# EAGLE design 1tm32 (EAGLE 9.6.2)
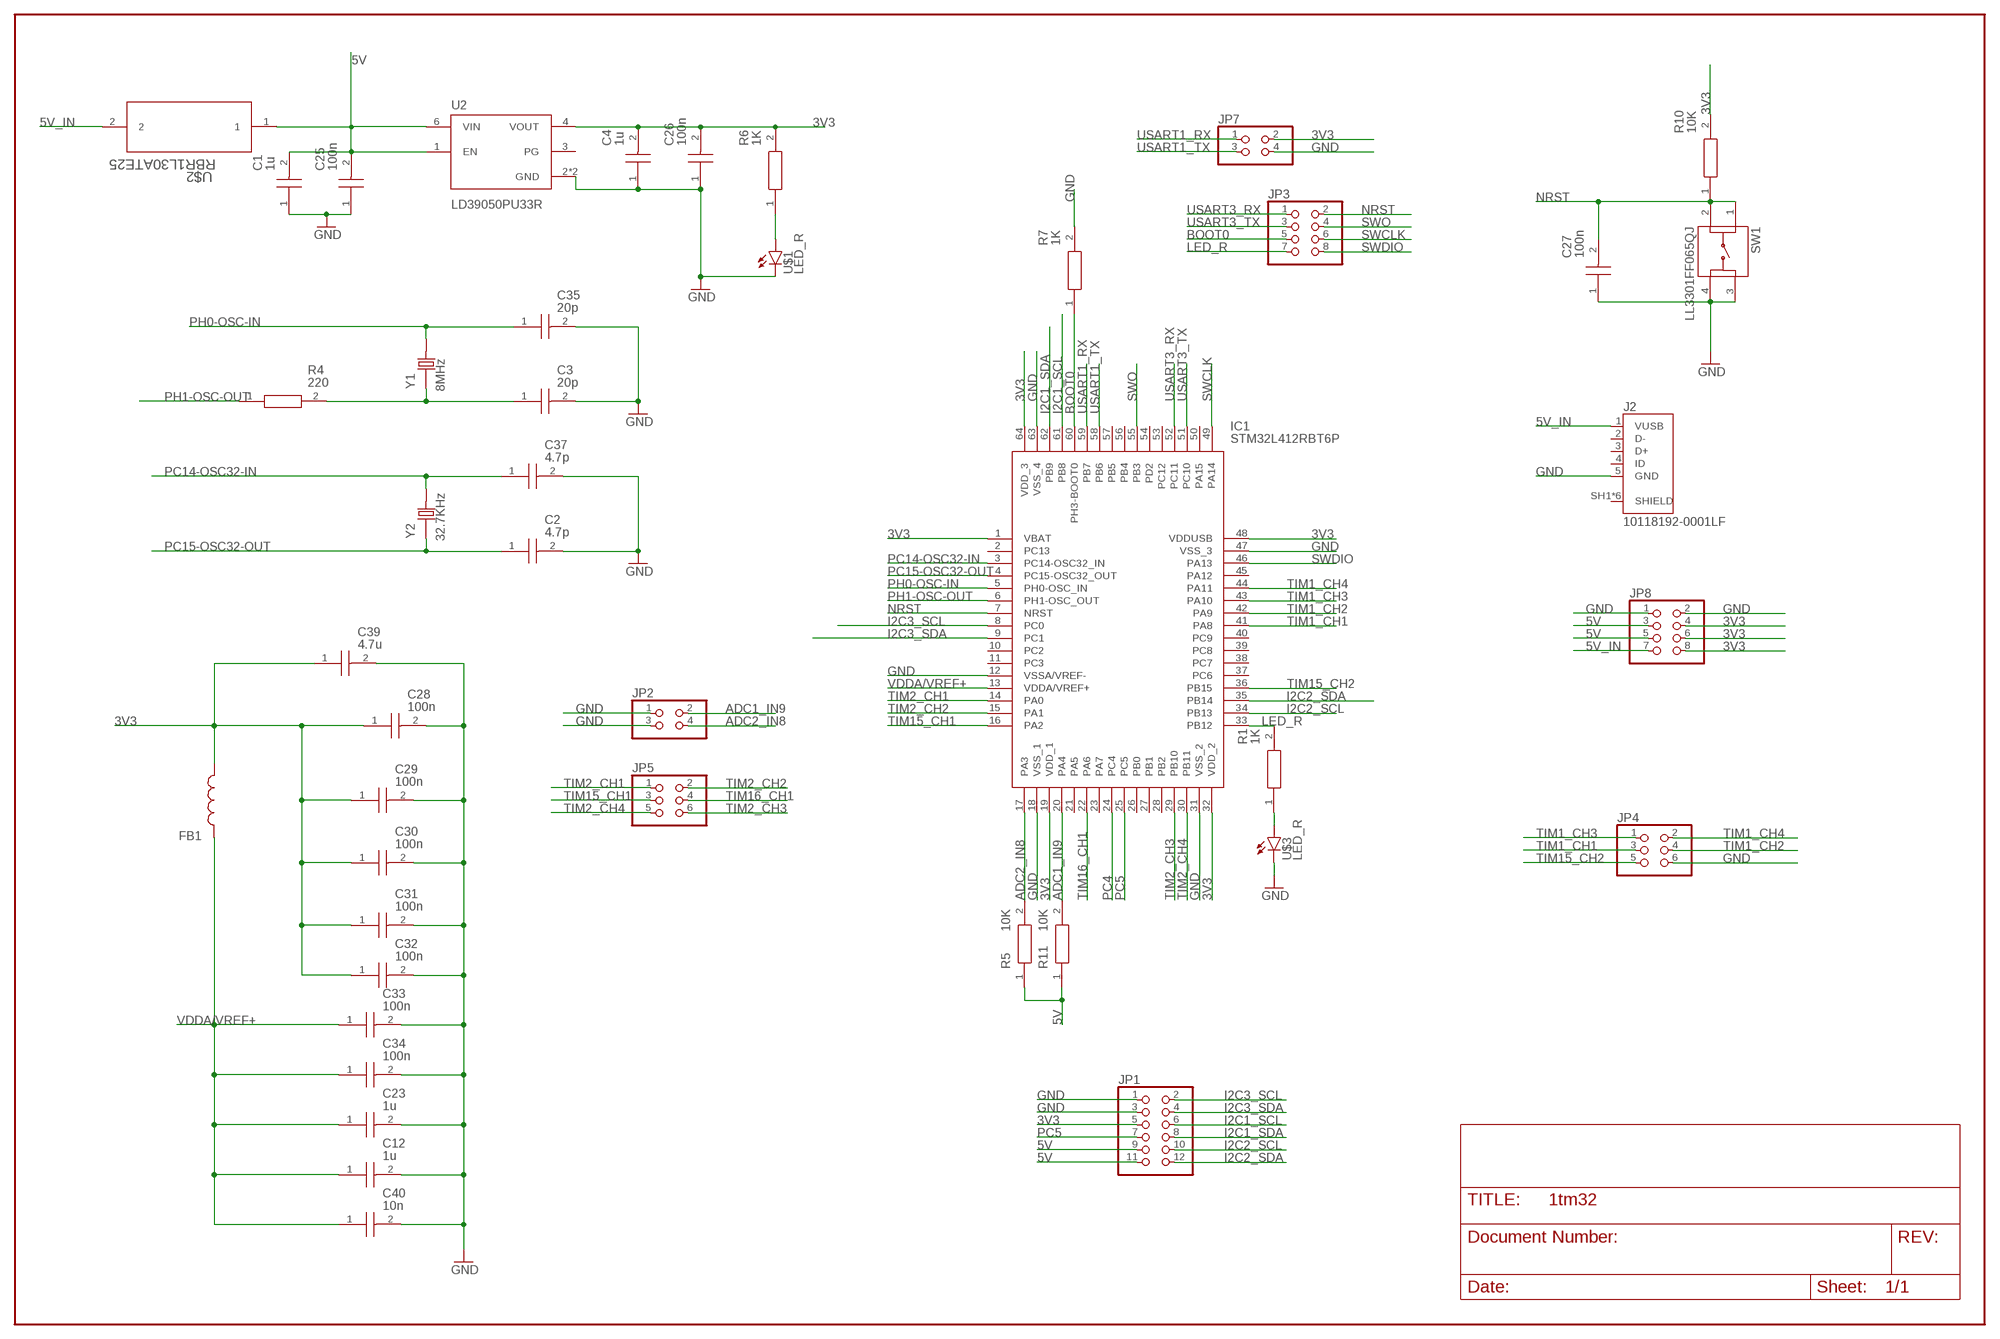
[diagram p0: schematic, sheet 1]

## Parts
C1  1u  GRM219R61H105KA73D  [CAPC2012X95N]
C2  4.7p  GQM2195C2E4R7BB12D  [CAPC2012X100N]
C3  20p  GQM2195G2H200GB12D  [CAPC2012X100N]
C4  1u  GRM219R61H105KA73D  [CAPC2012X95N]
C12  1u  GRM219R61H105KA73D  [CAPC2012X95N]
C23  1u  GRM219R61H105KA73D  [CAPC2012X95N]
C25  100n  GRT31C5C2A104JA12L  [CAPC3216X180N]
C26  100n  GRT31C5C2A104JA12L  [CAPC3216X180N]
C27  100n  GRT31C5C2A104JA12L  [CAPC3216X180N]
C28  100n  GRT31C5C2A104JA12L  [CAPC3216X180N]
C29  100n  GRT31C5C2A104JA12L  [CAPC3216X180N]
C30  100n  GRT31C5C2A104JA12L  [CAPC3216X180N]
C31  100n  GRT31C5C2A104JA12L  [CAPC3216X180N]
C32  100n  GRT31C5C2A104JA12L  [CAPC3216X180N]
C33  100n  GRT31C5C2A104JA12L  [CAPC3216X180N]
C34  100n  GRT31C5C2A104JA12L  [CAPC3216X180N]
C35  20p  GQM2195G2H200GB12D  [CAPC2012X100N]
C37  4.7p  GQM2195C2E4R7BB12D  [CAPC2012X100N]
C39  4.7u  GRT21BC71H475KE13L  [CAPC2012X145N]
C40  10n  GRM31CR73A103KW03L  [CAPC3216X180N]
FB1  BK1608HS601-T  [BEADC1608X95N]
IC1  STM32L412RBT6P  [QFP50P1200X1200X160-64N]
J2  10118192-0001LF  [AMPHENOL_10118192-0001LF]
JP1  PINHD-2X6  [2X06]
JP2  PINHD-2X2  [2X02]
JP3  PINHD-2X4  [2X04]
JP4  PINHD-2X3  [2X03]
JP5  PINHD-2X3  [2X03]
JP7  PINHD-2X2  [2X02]
JP8  PINHD-2X4  [2X04]
R1  1K  RC0805FR-131KL  [RESC2012X60N]
R4  220  RC0805FR-10220RL  [RESC2012X60N]
R5  10K  RC0805JR-0710KL  [RESC2012X60N]
R6  1K  RC0805FR-131KL  [RESC2012X60N]
R7  1K  RC0805FR-131KL  [RESC2012X60N]
R10  10K  RC0805JR-0710KL  [RESC2012X60N]
R11  10K  RC0805JR-0710KL  [RESC2012X60N]
SW1  LL3301FF065QJ  [LL3301FF065QJ]
U2  LD39050PU33R  [SON95P300X300X100-7N]
U$1  LED_R  SML-P12VTT86  [LED_SML-P11UTT86R]
U$2  RBR1L30ATE25  [DIO_RBR1L30_ROM]
U$3  LED_R  SML-P12VTT86  [LED_SML-P11UTT86R]
Y1  8MHz  ABLS-8.000MHZ-B2-T  [XTAL_ABLS-8.000MHZ-B2-T]
Y2  32.7KHz  ECS-.327-12.5-12QS-TR  [XTAL_ECS-.327-12.5-12QS-TR]

## Nets
3V3: C4.2 C26.2 C28.1 C29.1 C30.1 C31.1 C32.1 C39.1 FB1.2 IC1.1(VBAT) IC1.19(VDD_1) IC1.32(VDD_2) IC1.48(VDDUSB) IC1.64(VDD_3) JP1.5 JP7.2 JP8.4 JP8.6 JP8.8 R6.2 R10.2 U2.4(VOUT)
5V: C1.2 C25.2 JP1.9 JP1.11 JP8.3 JP8.5 R5.1 R11.1 U2.1(EN) U2.6(VIN) U$2.1
5V_IN: J2.1(VUSB) JP8.7 U$2.2
ADC1_IN9: IC1.20(PA4) JP2.2 R11.2
ADC2_IN8: IC1.17(PA3) JP2.4 R5.2
BOOT0: IC1.60(PH3-BOOT0) JP3.5 R7.1
GND: C1.1 C2.2 C3.2 C4.1 C12.2 C23.2 C25.1 C26.1 C27.1 C28.2 C29.2 C30.2 C31.2 C32.2 C33.2 C34.2 C35.2 C37.2 C39.2 C40.2 IC1.12(VSSA/VREF-) IC1.18(VSS_1) IC1.31(VSS_2) IC1.47(VSS_3) IC1.63(VSS_4) J2.5(GND) JP1.1 JP1.3 JP2.1 JP2.3 JP4.6 JP7.4 JP8.1 JP8.2 R7.2 SW1.3 SW1.4 U2.2(GND) U2.7(GND) U$1.C U$3.C
I2C1_SCL: IC1.61(PB8) JP1.6
I2C1_SDA: IC1.62(PB9) JP1.8
I2C2_SCL: IC1.34(PB13) JP1.10
I2C2_SDA: IC1.35(PB14) JP1.12
I2C3_SCL: IC1.8(PC0) JP1.2
I2C3_SDA: IC1.9(PC1) JP1.4
LED_R: IC1.33(PB12) JP3.7 R1.2
N$2: R1.1 U$3.A
N$3: C3.1 R4.2 Y1.1
N$5: R6.1 U$1.A
NRST: C27.2 IC1.7(NRST) JP3.2 R10.1 SW1.1 SW1.2
PC4: IC1.24(PC4)
PC5: IC1.25(PC5) JP1.7
PC14-OSC32-IN: C37.1 IC1.3(PC14-OSC32_IN) Y2.2
PC15-OSC32-OUT: C2.1 IC1.4(PC15-OSC32_OUT) Y2.1
PH0-OSC-IN: C35.1 IC1.5(PH0-OSC_IN) Y1.2
PH1-OSC-OUT: IC1.6(PH1-OSC_OUT) R4.1
SWCLK: IC1.49(PA14) JP3.6
SWDIO: IC1.46(PA13) JP3.8
SWO: IC1.55(PB3) JP3.4
TIM1_CH1: IC1.41(PA8) JP4.3
TIM1_CH2: IC1.42(PA9) JP4.4
TIM1_CH3: IC1.43(PA10) JP4.1
TIM1_CH4: IC1.44(PA11) JP4.2
TIM2_CH1: IC1.14(PA0) JP5.1
TIM2_CH2: IC1.15(PA1) JP5.2
TIM2_CH3: IC1.29(PB10) JP5.6
TIM2_CH4: IC1.30(PB11) JP5.5
TIM15_CH1: IC1.16(PA2) JP5.3
TIM15_CH2: IC1.36(PB15) JP4.5
TIM16_CH1: IC1.22(PA6) JP5.4
USART1_RX: IC1.59(PB7) JP7.1
USART1_TX: IC1.58(PB6) JP7.3
USART3_RX: IC1.52(PC11) JP3.1
USART3_TX: IC1.51(PC10) JP3.3
VDDA/VREF+: C12.1 C23.1 C33.1 C34.1 C40.1 FB1.1 IC1.13(VDDA/VREF+)
Unconnected: IC1.2(PC13) IC1.10(PC2) IC1.11(PC3) IC1.21(PA5) IC1.23(PA7) IC1.26(PB0) IC1.27(PB1) IC1.28(PB2) IC1.37(PC6) IC1.38(PC7) IC1.39(PC8) IC1.40(PC9) IC1.45(PA12) IC1.50(PA15) IC1.53(PC12) IC1.54(PD2) IC1.56(PB4) IC1.57(PB5) J2.2(D-) J2.3(D+) J2.4(ID) J2.SH1(SHIELD) J2.SH2(SHIELD) J2.SH3(SHIELD) J2.SH4(SHIELD) J2.SH5(SHIELD) J2.SH6(SHIELD) U2.3(PG)

## Library data of the parts
C1 C4 C12 C23 = GRM219R61H105KA73D(1u):GRM219R61H105KA73D: MURATA - GRM219R61H105KA73D - CAP, MLCC, X5R, 1UF, 50V, 0805 Source: Datasheet <https://datasheet.datasheetarchive.com/originals/distributors/DKDS-10/191852.pdf>; DESCRIPTION: MURATA - GRM219R61H105KA73D - CAP, MLCC, X5R, 1UF, 50V, 0805; HEIGHT: 0.95mm; MANUFACTURER_NAME: Murata Electronics; MANUFACTURER_PART_NUMBER: GRM219R61H105KA73D; MOUSER_PART_NUMBER: 81-GRM219R61H105KA3D; MOUSER_PRICE-STOCK: https://www.mouser.co.uk/ProductDetail/Murata-Electronics/GRM219R61H105KA73D?qs=O5cugoO6nweiD1nCQ5vS9w%3D%3D
C2 C37 = GQM2195C2E4R7BB12D(4_7p):GQM2195C2E4R7BB12D: Capacitor GQM21 L=2.0mm W=1.25mm T=0.85mm Source: Datasheet <https://psearch.en.murata.com/capacitor/product/GQM2195C2E4R7BB12#.html>; DESCRIPTION: Capacitor GQM21 L=2.0mm W=1.25mm T=0.85mm; HEIGHT: 1mm; MANUFACTURER_NAME: Murata Electronics; MANUFACTURER_PART_NUMBER: GQM2195C2E4R7BB12D; MOUSER_PART_NUMBER: 81-GQM2195C2E4R7BB2D; MOUSER_PRICE-STOCK: https://www.mouser.co.uk/ProductDetail/Murata-Electronics/GQM2195C2E4R7BB12D?qs=0JbGSuRBwBOIE8NOw5EJ%2FA%3D%3D
C3 C35 = GQM2195G2H200GB12D(20p):GQM2195G2H200GB12D: Capacitor GQM21 L=2.0mm W=1.25mm T=0.85mm Source: Datasheet <https://componentsearchengine.com/Datasheets/1/GQM2195G2H200GB12D.pdf>; DESCRIPTION: Capacitor GQM21 L=2.0mm W=1.25mm T=0.85mm; HEIGHT: 1mm; MANUFACTURER_NAME: Murata Electronics; MANUFACTURER_PART_NUMBER: GQM2195G2H200GB12D; MOUSER_PART_NUMBER: 81-GQM2195G2H200GB2D; MOUSER_PRICE-STOCK: https://www.mouser.com/Search/Refine.aspx?Keyword=81-GQM2195G2H200GB2D
C25-C34 = GRT31C5C2A104JA12L(0_1u):GRT31C5C2A104JA12L: Multilayer Ceramic Capacitors MLCC - SMD/SMT Source: Datasheet <https://www.murata.com/en-eu/products/productdetail?partno=GRT31C5C2A104JA12#>; DESCRIPTION: Multilayer Ceramic Capacitors MLCC - SMD/SMT; HEIGHT: 1.8mm; MANUFACTURER_NAME: Murata Electronics; MANUFACTURER_PART_NUMBER: GRT31C5C2A104JA12L; MOUSER_PART_NUMBER: 81-GRT31C5C2A104JA2L; MOUSER_PRICE-STOCK: https://www.mouser.co.uk/ProductDetail/Murata-Electronics/GRT31C5C2A104JA12L?qs=rI7uf1IzohSpYGEFBFd58g%3D%3D
C39 = GRT21BC71H475KE13L(4_7u):GRT21BC71H475KE13L: GRT21BC71H475KE13_ (0805, X7S:EIA, 4.7uF, DC50V) Source: Datasheet <https://search.murata.co.jp/Ceramy/image/img/A01X/G101/ENG/GRT21BC71H475KE13-01.pdf>; DESCRIPTION: GRT21BC71H475KE13_ (0805, X7S:EIA, 4.7uF, DC50V); HEIGHT: 1.45mm; MANUFACTURER_NAME: Murata Electronics; MANUFACTURER_PART_NUMBER: GRT21BC71H475KE13L; MOUSER_PART_NUMBER: 81-GRT21BC71H475KE3L; MOUSER_PRICE-STOCK: https://www.mouser.co.uk/ProductDetail/Murata-Electronics/GRT21BC71H475KE13L?qs=rI7uf1IzohQrtwc9u30k7A%3D%3D
C40 = GRM31CR73A103KW03L(0_01u):GRM31CR73A103KW03L: Murata 3216 GRM 10000pF Ceramic Multilayer Capacitor, 1000 V dc, +125C, X7R Dielectric, +/-10% Source: Datasheet <https://datasheet.datasheetarchive.com/originals/distributors/DKDS-10/192419.pdf>; DESCRIPTION: Murata 3216 GRM 10000pF Ceramic Multilayer Capacitor, 1000 V dc, +125C, X7R Dielectric, +/-10%; HEIGHT: 1.8mm; MANUFACTURER_NAME: Murata Electronics; MANUFACTURER_PART_NUMBER: GRM31CR73A103KW03L; MOUSER_PART_NUMBER: 81-GRM31CR73A103KW3L; MOUSER_PRICE-STOCK: https://www.mouser.co.uk/ProductDetail/Murata-Electronics/GRM31CR73A103KW03L?qs=hNud%2FORuBR1TymPCs4fJcA%3D%3D
FB1 = ce-capstone:BK1608HS601-T: Ferrite Chip Bead(Lead Free) Source: Datasheet <https://www.tai-tech.com.tw/_upload/files/FCM1608-Series.pdf>; DESCRIPTION: Ferrite Chip Bead(Lead Free); HEIGHT: 0.95mm; MANUFACTURER_NAME: Taiyo Yuden; MANUFACTURER_PART_NUMBER: BK1608HS601-T
IC1 = STM32L412RBT6P:STM32L412RBT6P: ARM Microcontrollers - MCU Source: Datasheet <https://www.st.com/resource/en/datasheet/stm32l412c8.pdf>; DESCRIPTION: ARM Microcontrollers - MCU; HEIGHT: 1.6mm; MANUFACTURER_NAME: STMicroelectronics; MANUFACTURER_PART_NUMBER: STM32L412RBT6P; MOUSER_PART_NUMBER: 511-STM32L412RBT6P; MOUSER_PRICE-STOCK: https://www.mouser.co.uk/ProductDetail/STMicroelectronics/STM32L412RBT6P?qs=l7cgNqFNU1hh%252BU1wOZs5Xg%3D%3D
J2 = ce-capstone:10118192-0001LF: Single Port 5 Contact Horizontal Right Angle Shielded Micro B USB 2.0 Connector; AVAILABILITY: Unavailable; DESCRIPTION: USB - micro B USB 2.0 Receptacle Connector 5 Position Surface Mount, Right Angle; MF: Amphenol ICC; MP: 10118192-0001LF; PACKAGE: None; PRICE: None
JP1 = pinhead:PINHD-2X6: PIN HEADER
JP2 JP7 = pinhead:PINHD-2X2: PIN HEADER
JP3 JP8 = pinhead:PINHD-2X4: PIN HEADER
JP4 JP5 = pinhead:PINHD-2X3: PIN HEADER
R1 R6 R7 = RC0805FR-131KL:RC0805FR-131KL: Thick Film Resistors - SMD 1 kOhms 250 mW 0805 1% Source: Datasheet <https://datasheet.datasheetarchive.com/originals/distributors/Datasheets_SAMA/902f9e387b938f871d31120f5fc1d65e.pdf>; DESCRIPTION: Thick Film Resistors - SMD 1 kOhms 250 mW 0805 1%; HEIGHT: 0.6mm; MANUFACTURER_NAME: KEMET; MANUFACTURER_PART_NUMBER: RC0805FR-131KL; MOUSER_PART_NUMBER: 603-RC0805FR-131KL; MOUSER_PRICE-STOCK: https://www.mouser.co.uk/ProductDetail/YAGEO/RC0805FR-131KL?qs=m6lXFsvg5e0qJLgmV7HC3Q%3D%3D
R4 = RC0805FR-10220RL:RC0805FR-10220RL: Thick Film Resistors - SMD 220 OHM 1% Source: Datasheet; DESCRIPTION: Thick Film Resistors - SMD 220 OHM 1%; HEIGHT: 0.6mm; MANUFACTURER_NAME: KEMET; MANUFACTURER_PART_NUMBER: RC0805FR-10220RL; MOUSER_PART_NUMBER: 603-RC0805FR-10220RL; MOUSER_PRICE-STOCK: https://www.mouser.co.uk/ProductDetail/YAGEO/RC0805FR-10220RL?qs=m6lXFsvg5e0JpfeoSKi9%252BQ%3D%3D
R5 R10 R11 = RC0805JR-0710KL:RC0805JR-0710KL: YAGEO - RC0805JR-0710KL - SMD Chip Resistor, 0805 [2012 Metric], 10 kohm, RC Series, 150 V, Thick Film, 125 mW Source: Datasheet <https://datasheet.datasheetarchive.com/originals/distributors/Datasheets_SAMA/902f9e387b938f871d31120f5fc1d65e.pdf>; DESCRIPTION: YAGEO - RC0805JR-0710KL - SMD Chip Resistor, 0805 [2012 Metric], 10 kohm, RC Series, 150 V, Thick Film, 125 mW; HEIGHT: 0.6mm; MANUFACTURER_NAME: KEMET; MANUFACTURER_PART_NUMBER: RC0805JR-0710KL; MOUSER_PART_NUMBER: 603-RC0805JR-0710KL; MOUSER_PRICE-STOCK: https://www.mouser.co.uk/ProductDetail/YAGEO/RC0805JR-0710KL?qs=ZFGQJeMQzF5q%2Fp77vM%2FrVQ%3D%3D
SW1 = ce-capstone:LL3301FF065QJ: Pushbutton Switches 50mA 12VDC F065 7.0mm J-Lead Source: Datasheet <https://componentsearchengine.com/Datasheets/1/LL3301FF065QJ.pdf>; DESCRIPTION: Pushbutton Switches 50mA 12VDC F065 7.0mm J-Lead; HEIGHT: 7.3mm; MANUFACTURER_NAME: E-Switch; MANUFACTURER_PART_NUMBER: LL3301FF065QJ; MOUSER_PART_NUMBER: 612-LL3301FF065QJ; MOUSER_PRICE-STOCK: https://www.mouser.com/Search/Refine.aspx?Keyword=612-LL3301FF065QJ
U2 = ce-capstone:LD39050PU33R: LD39050 Series 500 mA 3.3 V Fixed Low Noise LDO Voltage Regulator - DFN-6; AVAILABILITY: Unavailable; DESCRIPTION: Linear Voltage Regulator IC 1 Output 500mA 6-DFN _3x3_; MF: STMicroelectronics; MP: LD39050PU33R; PACKAGE: DFN-6 STMicroelectronics; PRICE: None
U$1 U$3 = ce-capstone:SML-P12VTT86: SML-P1 Series Red 0402 Clear 60 mcd 2 V Surface Mount PICOLED LED; AVAILABILITY: Unavailable; DESCRIPTION: Red 630nm LED Indication - Discrete 2V 0402 _1006 Metric_; MF: Rohm; MP: SML-P12VTT86; PACKAGE: 0402 Rohm; PRICE: None
U$2 = RBR1L30ATE25(scho_diode):RBR1L30ATE25; COPYRIGHT: Copyright (C) 2023 Ultra Librarian. All rights reserved.; DIGI-KEY_PART_NUMBER_1: RBR1L30ATE25CT-ND; DIGI-KEY_PART_NUMBER_2: RBR1L30ATE25DKR-ND; DIGI-KEY_PART_NUMBER_3: RBR1L30ATE25TR-ND; MANUFACTURER_PART_NUMBER: RBR1L30ATE25; MFR_NAME: ROHM Semiconductor
Y1 = ce-capstone:ABLS-8.000MHZ-B2-T: Crystal 8MHz Â±20ppm (Tol) Â±50ppm (Stability) 18pF FUND 80Ohm 2-Pin HC-49/US SMD T/R; AVAILABILITY: Unavailable; DESCRIPTION: 8MHz ±20ppm Crystal 18pF 80 Ohms HC-49/US; MF: Abracon LLC; MP: ABLS-8.000MHZ-B2; PACKAGE: HC-49/US Abracon LLC; PRICE: None
Y2 = ce-capstone:ECS-.327-12.5-12QS-TR: SMD CRYSTAL 32.768 KHz; AVAILABILITY: Unavailable; DESCRIPTION: 32.768kHz ±20ppm Crystal 12.5pF 90 kOhms 2-SMD, No Lead; MF: ECS Inc.; MP: ECS-.327-12.5-12QS-TR; PACKAGE: SMD-2 ECS International; PRICE: None

## Board
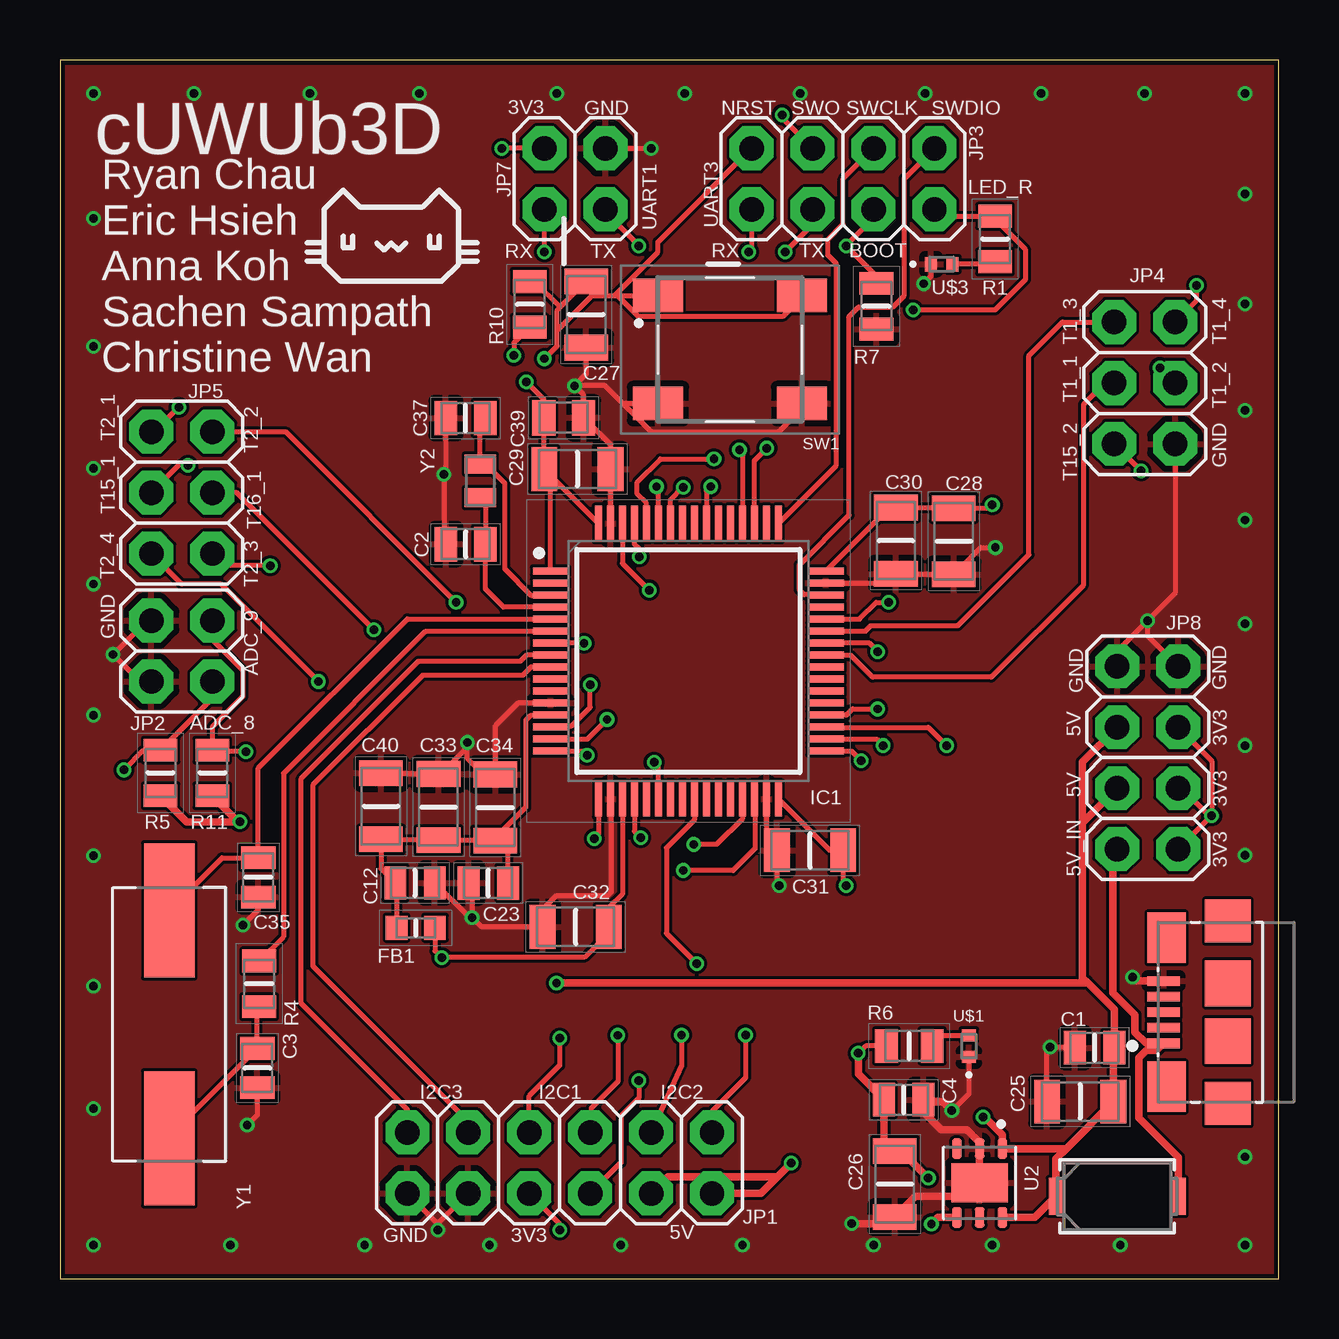
[diagram p1: board, top side]
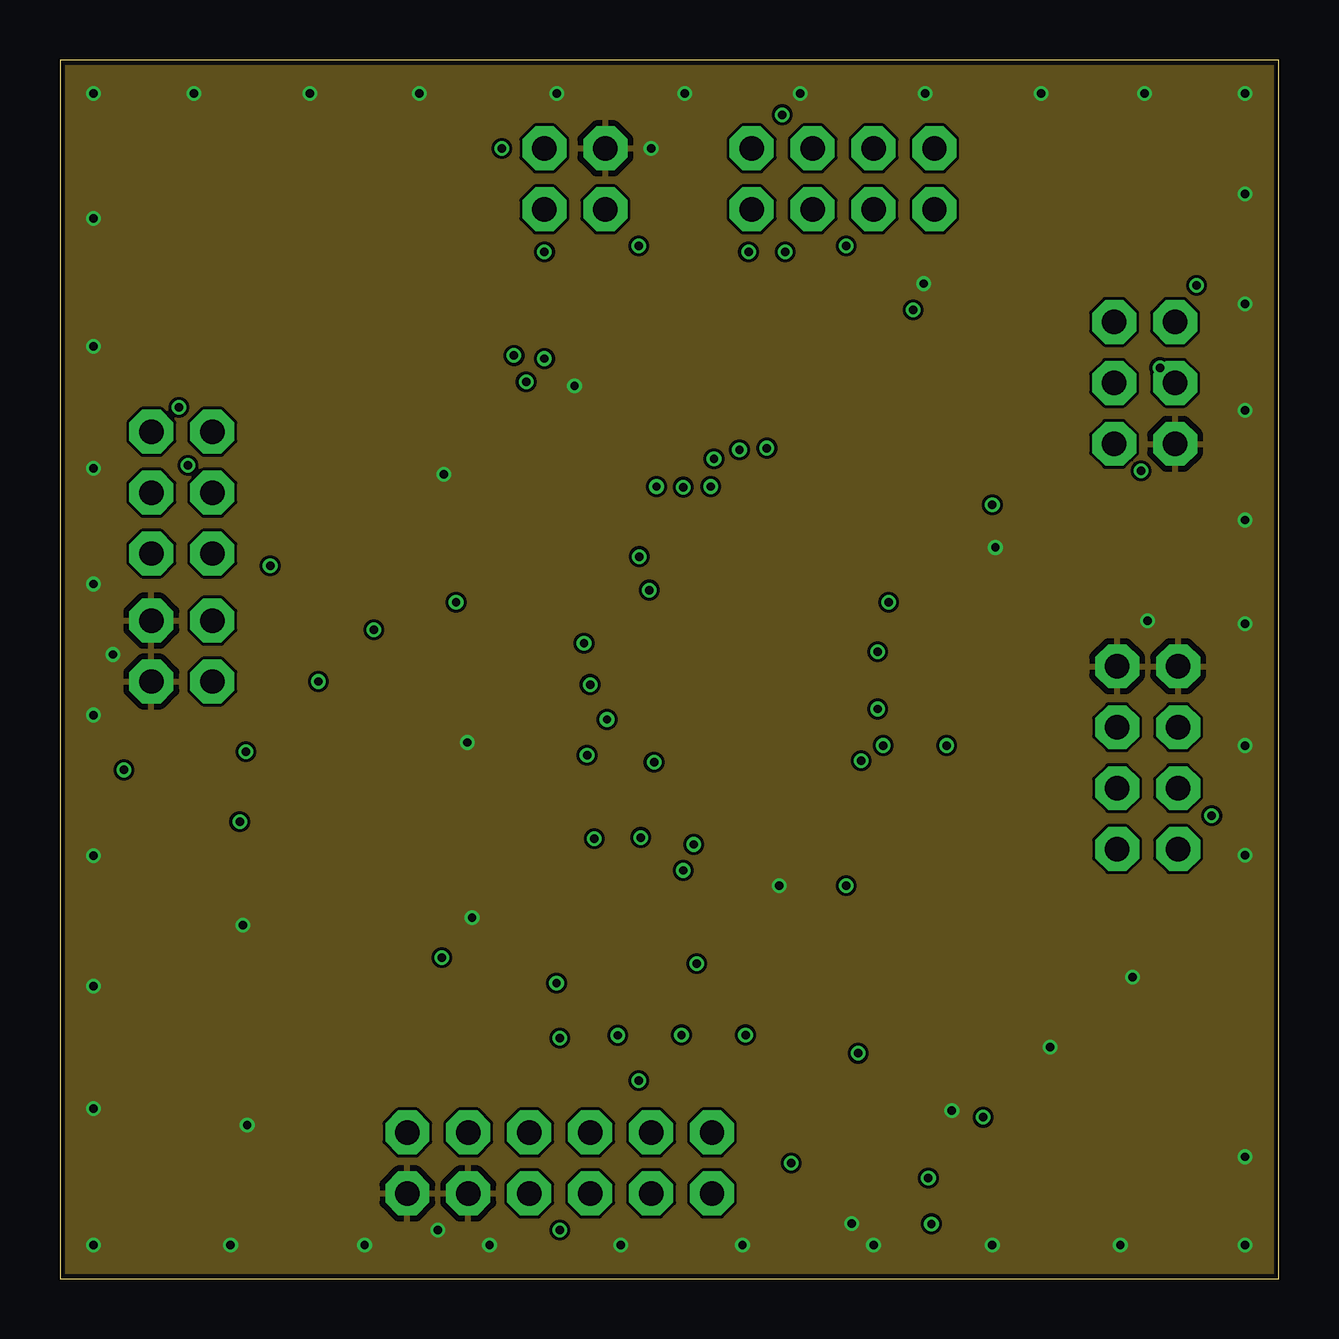
[diagram p2: board, inner layer Route2]
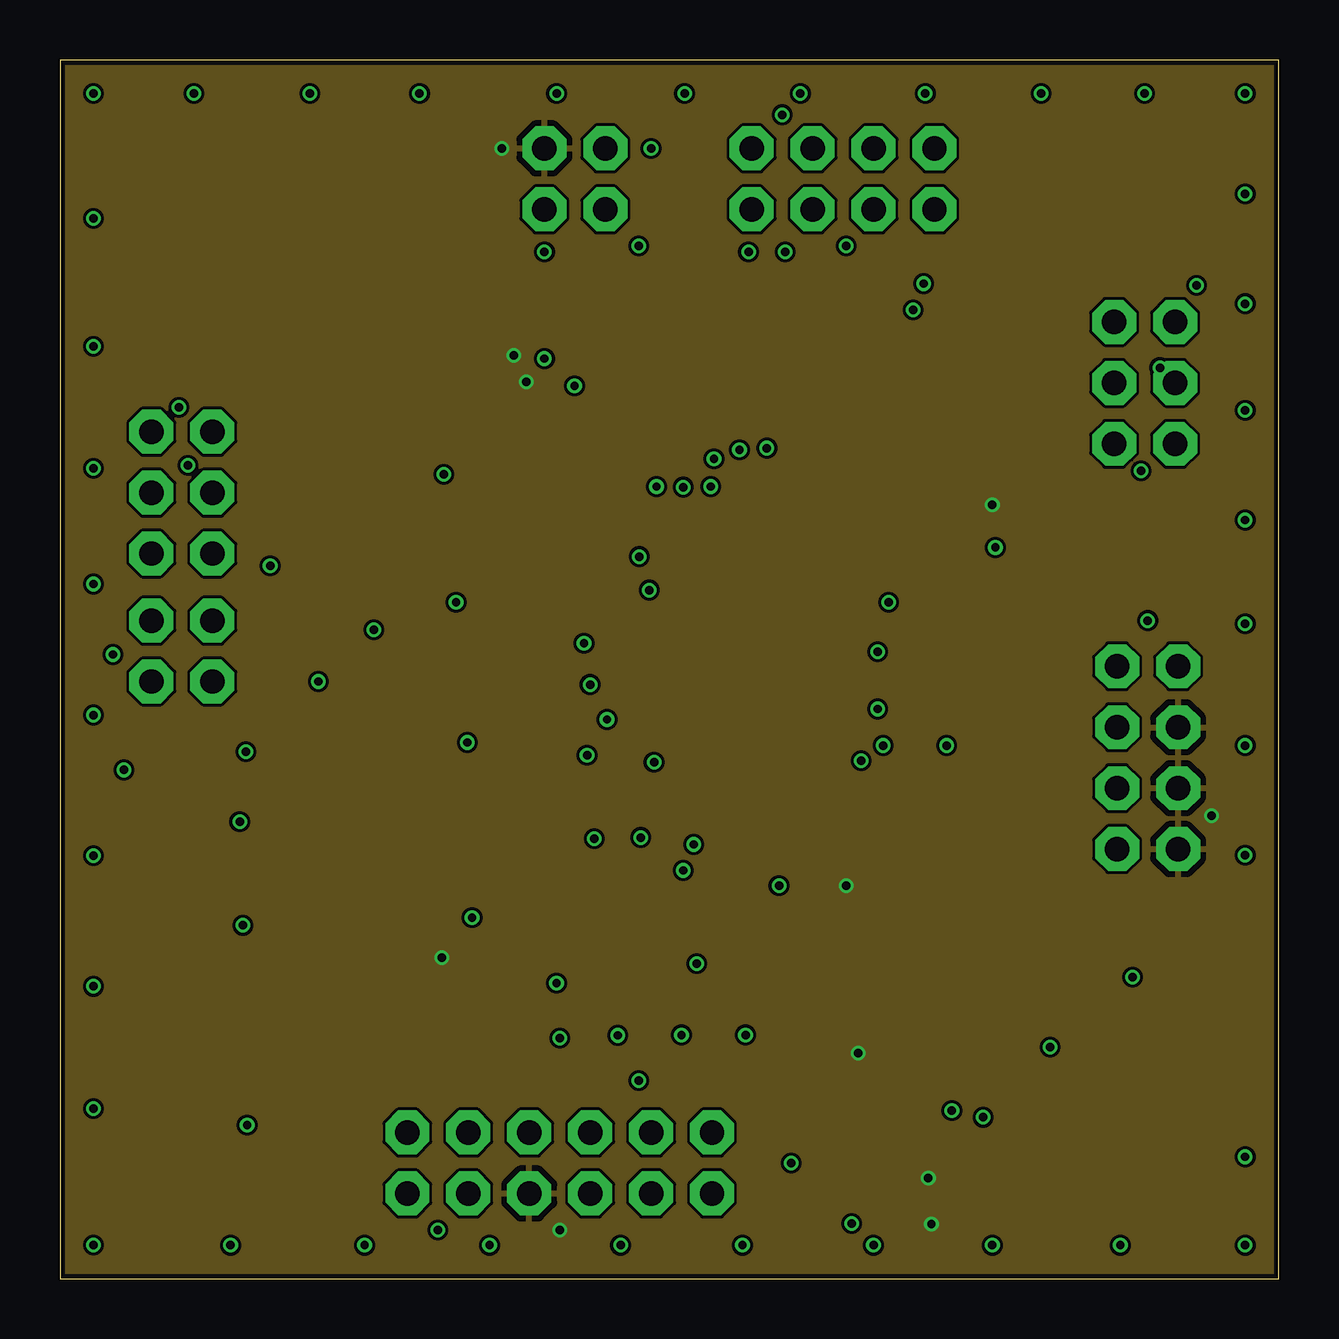
[diagram p3: board, inner layer Route15]
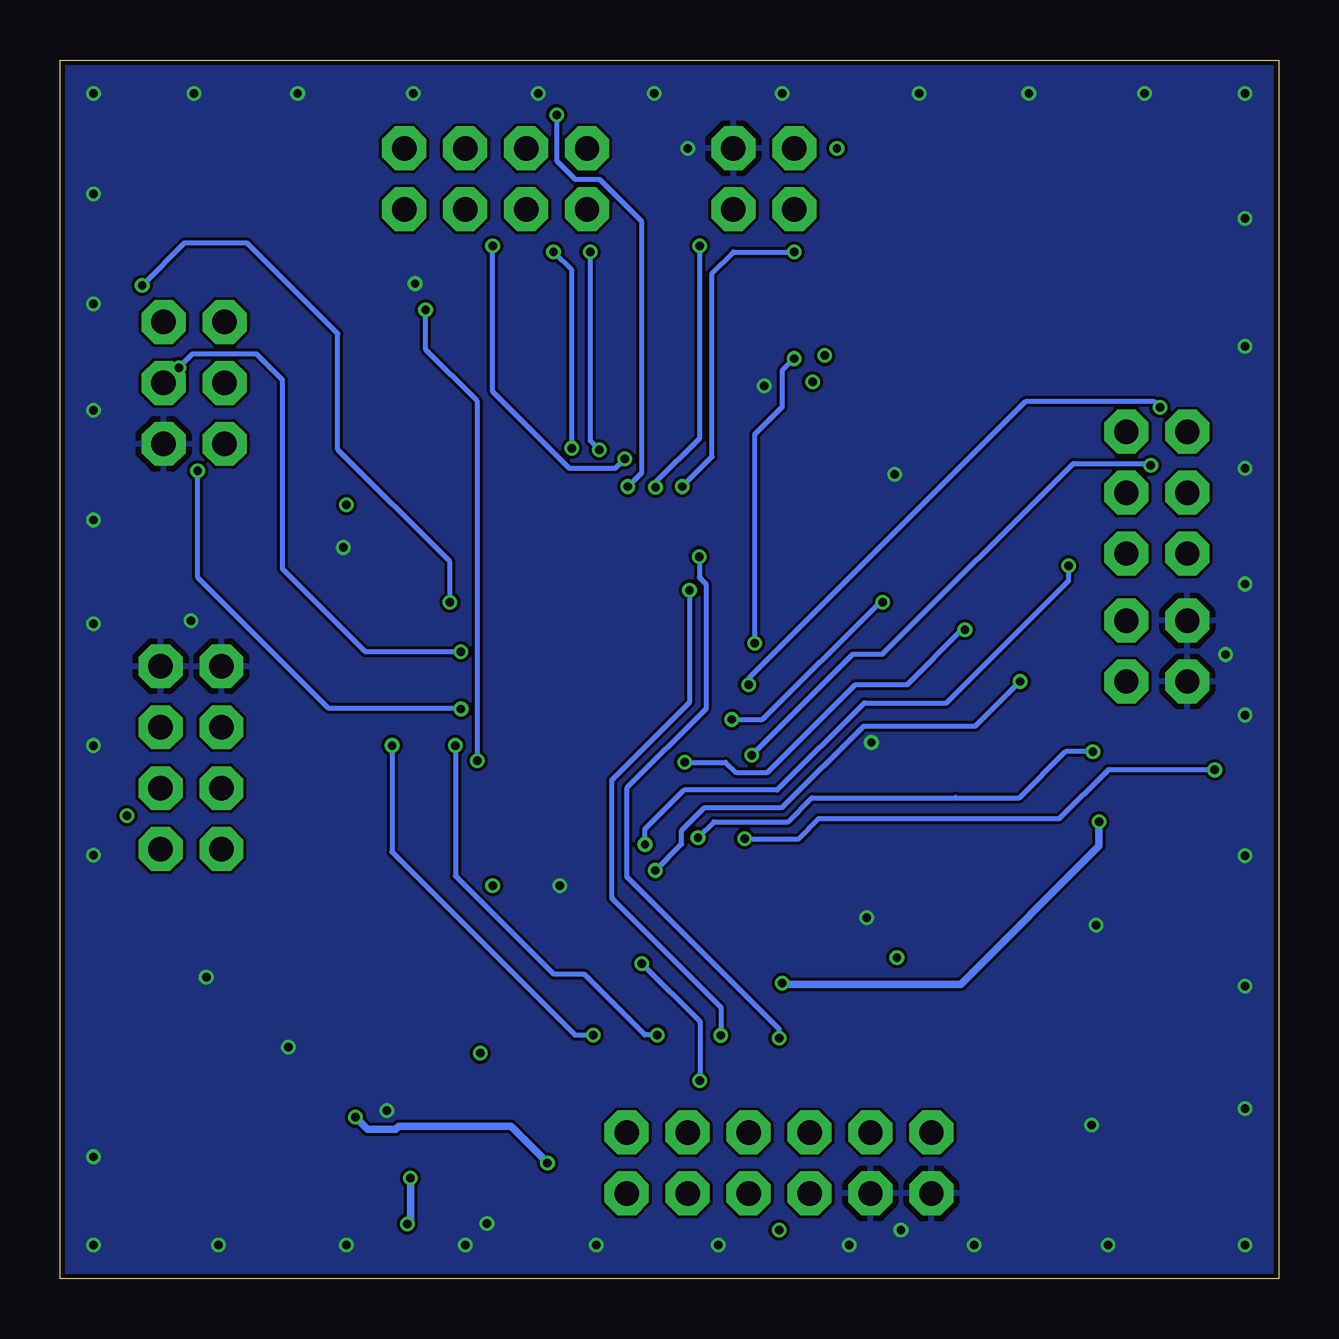
[diagram p4: board, bottom side, seen from below]

Size 50.8 x 50.8 mm. Coordinates in mm from the lower left corner, seen from the top.
Outline: 0,0 50.8,0 50.8,50.8 0,50.8 0,0
Copper layers (1+2*15+16): Top 0.035mm / dielectric 0.2mm / Route2 0.0175mm / dielectric 1.065mm / Route15 0.0175mm / dielectric 0.2mm / Bottom 0.035mm
Design rules "jlcpcb-4layers": minimum track width 3.5mil, minimum drill 0.2mm, track to track 5mil, track to pad 0.2mm, pad to pad 5mil, via to via 0.5mm, smd to smd 5mil, copper to edge 0.2mm, drill to drill 6mil, minimum pad ring 10mil, minimum via ring 0.13mm, stop-mask expansion 0.05mm, vias tented up to drill 16mil, thermal gap 10mil

### Footprints (pad centres in the part's own frame; a part is rotated, then mirrored left to right if it is on the bottom)
CAPC2012X95N = smd 0.91 x 1.39: 1 -0.82,0; 2 0.82,0
CAPC2012X100N = smd 0.94 x 1.43: 1 -0.82,0; 2 0.82,0
CAPC3216X180N = smd 1.07 x 1.82: 1 -1.38,0; 2 1.38,0
CAPC2012X145N = smd 0.97 x 1.47: 1 -0.83,0; 2 0.83,0
BEADC1608X95N = smd 0.9 x 1: 1 -0.8,0; 2 0.8,0
QFP50P1200X1200X160-64N = smd 1.475 x 0.3: 1 -5.738,3.75; 2 -5.738,3.25; 3 -5.738,2.75; 4 -5.738,2.25; 5 -5.738,1.75; 6 -5.738,1.25; 7 -5.738,0.75; 8 -5.738,0.25; 9 -5.738,-0.25; 10 -5.738,-0.75; 11 -5.738,-1.25; 12 -5.738,-1.75; 13 -5.738,-2.25; 14 -5.738,-2.75; 15 -5.738,-3.25; 16 -5.738,-3.75; 33 5.738,-3.75; 34 5.738,-3.25; 35 5.738,-2.75; 36 5.738,-2.25; 37 5.738,-1.75; 38 5.738,-1.25; 39 5.738,-0.75; 40 5.738,-0.25; 41 5.738,0.25; 42 5.738,0.75; 43 5.738,1.25; 44 5.738,1.75; 45 5.738,2.25; 46 5.738,2.75; 47 5.738,3.25; 48 5.738,3.75 | smd 0.3 x 1.475: 17 -3.75,-5.738; 18 -3.25,-5.738; 19 -2.75,-5.738; 20 -2.25,-5.738; 21 -1.75,-5.738; 22 -1.25,-5.738; 23 -0.75,-5.738; 24 -0.25,-5.738; 25 0.25,-5.738; 26 0.75,-5.738; 27 1.25,-5.738; 28 1.75,-5.738; 29 2.25,-5.738; 30 2.75,-5.738; 31 3.25,-5.738; 32 3.75,-5.738; 49 3.75,5.738; 50 3.25,5.738; 51 2.75,5.738; 52 2.25,5.738; 53 1.75,5.738; 54 1.25,5.738; 55 0.75,5.738; 56 0.25,5.738; 57 -0.25,5.738; 58 -0.75,5.738; 59 -1.25,5.738; 60 -1.75,5.738; 61 -2.25,5.738; 62 -2.75,5.738; 63 -3.25,5.738; 64 -3.75,5.738
AMPHENOL_10118192-0001LF = smd 0.4 x 1.35: 1 -1.3,0; 2 -0.65,0; 3 0,0; 4 0.65,0; 5 1.3,0 | smd 2.1 x 1.6: SH1 -3.1,-0.125; SH2 3.1,-0.125 | smd 1.8 x 1.9: SH3 -3.8,-2.675; SH6 3.8,-2.675 | smd 1.9 x 1.9: SH4 -1.2,-2.675; SH5 1.2,-2.675
2X06 = drill 1.016 octagon: 1 -6.35,-1.27; 2 -6.35,1.27; 3 -3.81,-1.27; 4 -3.81,1.27; 5 -1.27,-1.27; 6 -1.27,1.27; 7 1.27,-1.27; 8 1.27,1.27; 9 3.81,-1.27; 10 3.81,1.27; 11 6.35,-1.27; 12 6.35,1.27
2X02 = drill 1.016 octagon: 1 -1.27,-1.27; 2 -1.27,1.27; 3 1.27,-1.27; 4 1.27,1.27
2X04 = drill 1.016 octagon: 1 -3.81,-1.27; 2 -3.81,1.27; 3 -1.27,-1.27; 4 -1.27,1.27; 5 1.27,-1.27; 6 1.27,1.27; 7 3.81,-1.27; 8 3.81,1.27
2X03 = drill 1.016 octagon: 1 -2.54,-1.27; 2 -2.54,1.27; 3 0,-1.27; 4 0,1.27; 5 2.54,-1.27; 6 2.54,1.27
RESC2012X60N = smd 0.95 x 1.4: 1 -0.95,0; 2 0.95,0
LL3301FF065QJ = smd 2.1 x 1.4: 1 -3,2.25; 2 3,2.25; 3 -3,-2.25; 4 3,-2.25
SON95P300X300X100-7N = smd 0.84 x 0.4: 1 -1.435,0.95; 2 -1.435,0; 3 -1.435,-0.95; 4 1.435,-0.95; 5 1.435,0; 6 1.435,0.95 | smd 1.625 x 2.365: 7 0,0
LED_SML-P11UTT86R = smd 0.5 x 0.6: A 0.45,0; C -0.45,0
DIO_RBR1L30_ROM = smd 0.61 x 1.549: 1 -2.553,0; 2 2.553,0
XTAL_ABLS-8.000MHZ-B2-T = smd 5.6 x 2.1: 1 -4.75,0; 2 4.75,0
XTAL_ECS-.327-12.5-12QS-TR = smd 0.8 x 1.3: 1 -0.7,0; 2 0.7,0

### Placement (x,y rotation side)
C1  43.12,9.63 0 top
C2  16.91,30.62 180 top
C3  8.23,8.78 270 top
C4  35.17,7.46 180 top
C12  14.8,16.5 0 top
C23  17.85,16.49 180 top
C25  42.52,7.39 0 top
C26  34.8,3.95 90 top
C27  21.94,40.19 90 top
C28  37.25,30.74 270 top
C29  21.57,33.75 0 top
C30  34.84,30.76 270 top
C31  31.26,17.86 180 top
C32  21.49,14.67 180 top
C33  15.78,19.66 90 top
C34  18.15,19.64 90 top
C35  8.27,16.73 270 top
C37  16.9,35.87 180 top
C39  20.99,35.89 0 top
C40  13.38,19.7 90 top
FB1  14.83,14.62 0 top
IC1  26.19,25.74 0 top
J2  46,11.11 90 top
JP1  20.83,4.83 0 top
JP2  5.08,26.16 270 top
JP3  32.64,45.85 0 top
JP4  45.21,37.34 270 top
JP5  5.08,32.77 270 top
JP7  21.46,45.85 0 top
JP8  45.34,21.72 270 top
R1  38.98,43.34 90 top
R4  8.3,12.29 270 top
R5  4.19,21.08 90 top
R6  35.4,9.7 180 top
R7  34.03,40.54 270 top
R10  19.58,40.62 270 top
R11  6.35,21.08 90 top
SW1  27.93,38.73 0 top
U2  38.33,3.99 270 top
U$1  37.89,9.7 90 top
U$2  44.07,3.43 0 top
U$3  36.76,42.28 0 top
Y1  4.56,10.6 90 top
Y2  17.52,33.26 90 top

### Tracks (layer width: path | path; a pad name or v marks a point on that pad's centre or on a via)
3V3  (via drill 0.35)
  Top 0.203: 34.8,5.2 C26.2 | IC1.19 23.44,16.02 22.87,15.45 C32.1 22.87,14.41 21.86,13.4 15.93,13.4 v15.91,13.38 15.63,13.66 FB1.2 | R6.2 33.58,9.7 v33.27,9.4 | IC1.64 20.45,33.47 | v19.43,37.39 20.16,36.66 C39.1 20.16,33.77 C29.1 20.19,33.74 20.45,33.47 | IC1.1 20.45,33.47 | IC1.32 32.09,17.86 C31.1 32.64,16.51 v32.77,16.38 | IC1.48 34.58,32.14 C30.1 37.23,32.14 C28.1 38.72,32.12 v38.86,32.26 | JP7.2 v18.41,47.12 | R10.2 18.92,39.01 v18.92,38.48 | JP8.8 47.94,19.24 | 47.94,19.24 v48.01,19.3 48.01,21.59 JP8.4 | JP8.6 46.74,20.45 47.94,19.24 | JP1.5 20.83,2.29 v20.83,2.03
  Top 0.305: v33.27,9.4 33.27,8.53 C4.2 34.35,5.55 34.8,5.1 34.8,5.2 35.19,5.2 v36.2,4.19 | U2.4 36.59,2.55 v36.32,2.29
  Bottom 0.305: v36.32,2.29 36.2,2.41 v36.2,4.19
  pour Route15: 0,50.8 20.9,50.8 30,50.8 50.8,50.8 50.8,0 0,0
5V  (via drill 0.35)
  Top 0.305: 41.94,5.42 U2.1 39.28,6 38.55,6.73 v38.48,6.73 | 41.94,5.42 C25.2 43.9,9.59 C1.2 43.94,11.22 42.84,12.32 | 42.62,19 JP8.5 | 42.62,19 42.62,12.54 42.84,12.32 | 42.62,19 42.62,21.54 JP8.3 | v30.48,4.83 29.91,4.25 | 29.91,4.25 29.21,3.56 JP1.11 | 29.91,4.25 25.34,4.25 JP1.9 | 42.84,12.32 v20.7,12.32 | U2.6 40.64,2.55 U$2.1 41.52,5 41.94,5.42 | R11.1 7.43,19.05 v7.49,19.05 5.27,19.05 R5.1
  Bottom 0.305: v38.48,6.73 37.97,6.22 36.81,6.22 36.68,6.35 32,6.35 v30.48,4.83 | v20.7,12.32 20.65,12.27 13.26,12.27 7.49,18.03 v7.49,19.05
5V_IN
  Top 0.305: JP8.7 43.89,17.73 43.89,11.92 44.81,11.01 44.81,10.27 45.25,9.83 45.98,9.83 J2.1 45.71,9.52 45.28,9.52 44.97,9.21 44.97,6.71 46.62,5.05 U$2.2
ADC1_IN9  (via drill 0.35)
  Top 0.203: IC1.20 23.94,18.65 v24.21,18.39 | JP2.2 6.35,26.63 7.62,25.36 7.62,24.27 6.35,23 R11.2 6.41,21.97 v7.75,21.97
  Bottom 0.203: v24.21,18.39 23.55,19.05 20.44,19.05 19.45,20.04 13.49,20.04 13.46,20.07 13.44,20.04 10.82,20.04 8.89,21.97 v7.75,21.97
ADC2_IN8  (via drill 0.35)
  Top 0.203: IC1.17 22.44,18.52 v22.27,18.34 | JP2.4 6.35,24.19 R5.2 3.49,22.03 v2.67,21.21
  Bottom 0.203: v22.27,18.34 20,18.34 19.17,19.18 9.14,19.18 7.11,21.21 v2.67,21.21
BOOT0  (via drill 0.35)
  Top 0.203: v27.26,34.17 25.02,34.17 24.06,33.21 24.06,32.71 24.44,32.32 IC1.60 | R7.1 34.03,41.79 v32.77,43.05 33.91,44.2 JP3.5
  Bottom 0.203: v27.26,34.17 27.65,33.78 29.57,33.78 32.77,36.98 v32.77,43.05
GND  (via drill 0.35)
  Top 0.203: U$1.C 37.89,7.72 v37.17,7 | IC1.63 C29.2 22.95,34.76 C39.2 21.82,36.84 v21.45,37.22 | IC1.12 19.09,23.99 18.15,23.05 C34.2 17.65,21.02 16.98,21.69 16.98,22.14 | C40.2 13.41,21.04 C33.2 15.88,21.04 16.98,22.14 | C23.2 17.18,16.64 v17.18,15.05 | IC1.18 22.97,19.98 22.97,16.11 22.82,15.97 20.68,15.97 20.11,15.4 C32.2 17.56,14.67 v17.18,15.05 | C12.2 17.07,15.05 v17.18,15.05 | 16.98,22.14 v16.98,22.35 | C3.2 8.23,6.83 v7.8,6.4 | C25.1 41.14,9.52 v41.27,9.65 42.28,9.65 C1.1 | IC1.31 29.44,18.3 C31.2 29.88,16.47 v29.97,16.38 | IC1.47 34.45,28.99 C30.2 37.23,29.38 C28.2 38.38,30.48 v38.99,30.48 | C37.2 16.08,33.61 v16,33.53 16,30.7 C2.2 | C27.1 21.94,37.71 v21.45,37.22 | SW1.3 23.46,36.48 | v21.45,37.22 22.73,37.22 23.46,36.48 | 23.46,36.48 24.64,35.31 29.97,35.31 30.93,36.26 SW1.4 | JP7.4 v24.64,47.12 | JP8.2 45.34,26.8 v45.34,27.43 | JP8.1 44.07,26.16 v45.34,27.43 | JP4.6 46.48,28.57 v45.34,27.43 | JP1.3 15.75,2.29 | JP1.1 15.75,2.29 | 15.75,2.29 v15.75,2.03 | JP2.1 3.62,27.43 v2.21,26.02 3.34,24.89 JP2.3 | U$3.C 36.3,41.78 v36,41.48 | C35.2 8.27,15.38 v7.62,14.73
  Top 0.305: J2.5 44.87,12.41 v44.7,12.57 | v33,2.3 34.53,2.3 C26.1 35.66,3.43 37.77,3.43 U2.7 U2.2 38.33,5.66 38.27,5.72 38.28,5.72 37.8,6.2 36.74,6.2 35.99,6.95 C4.1 36.08,7.37 36.81,7.37 v37.17,7
  other vias: 1.4,1.4 7.11,1.4 12.7,1.4 17.91,1.4 23.37,1.4 28.45,1.4 33.91,1.4 38.86,1.4 44.2,1.4 49.4,1.4 49.4,5.08 49.4,17.65 49.4,22.23 49.4,27.3 49.4,31.62 49.4,36.2 49.4,40.64 49.4,45.21 49.4,49.4 45.21,49.4 40.89,49.4 36.07,49.4 14.99,49.4 10.41,49.4 5.59,49.4 1.4,49.4 1.4,44.2 1.4,38.86 1.4,33.78 1.4,28.96 1.4,23.5 1.4,17.64 1.4,12.19 1.4,7.09 20.7,49.4 26.04,49.4 30.86,49.4
  pour Top: 0,50.8 20.9,50.8 30,50.8 50.8,50.8 50.8,0 0,0
  pour Bottom: 0,50.8 20.9,50.8 30,50.8 50.8,50.8 50.8,0 0,0
  pour Route2: 0,50.8 20.9,50.8 30,50.8 50.8,50.8 50.8,0 0,0
I2C1_SCL  (via drill 0.35)
  Top 0.203: IC1.61 23.94,30.64 24.15,30.43 v24.15,30.1 | JP1.6 19.56,7.62 20.83,8.89 v20.83,10.03
  Bottom 0.203: v24.15,30.1 24.15,29.23 23.88,28.96 23.88,23.75 27.18,20.45 27.18,16.76 20.83,10.41 v20.83,10.03
I2C1_SDA  (via drill 0.35)
  Top 0.203: IC1.62 23.44,29.82 v24.56,28.7 | JP1.8 22.14,6.14 22.14,7.11 23.25,8.22 v23.25,10.15
  Bottom 0.203: v24.56,28.7 24.56,24.02 27.81,20.77 27.81,15.87 23.25,11.32 v23.25,10.15
I2C2_SCL  (via drill 0.35)
  Top 0.203: IC1.34 34.05,22.49 v34.31,22.23 | v25.91,10.16 25.91,8.89 JP1.10
  Bottom 0.203: v34.31,22.23 34.31,16.79 30.23,12.7 28.96,12.7 26.42,10.16 v25.91,10.16
I2C2_SDA  (via drill 0.35)
  Top 0.203: IC1.35 36.2,22.99 v36.96,22.23 | v28.57,10.16 28.57,8.38 27.18,6.99 JP1.12
  Bottom 0.203: v36.96,22.23 36.96,17.78 29.34,10.16 v28.57,10.16
I2C3_SCL
  Top 0.203: IC1.8 19.45,25.99 19.18,25.73 14.94,25.73 10.03,20.83 10.03,11.5 14.48,7.05 JP1.2
I2C3_SDA
  Top 0.203: IC1.9 19.64,25.5 19.28,25.15 15.11,25.15 10.54,20.58 10.54,13.03 17.02,6.55 JP1.4
LED_R  (via drill 0.35)
  Top 0.203: JP3.7 36.74,44.29 38.86,44.29 | 38.86,44.29 R1.2 | IC1.33 33,21.99 v33.4,21.59 | v35.56,40.39 38.99,40.39 40.26,41.66 40.26,42.89 38.86,44.29
  Bottom 0.203: v33.4,21.59 33.4,36.58 35.56,38.73 v35.56,40.39
N$2
  Top 0.203: R1.1 38.87,42.28 U$3.A
N$3
  Top 0.203: Y1.1 4.56,5.93 C3.1 8.23,11.27 R4.2
N$5
  Top 0.203: R6.1 36.8,10.15 U$1.A
NRST  (via drill 0.35)
  Top 0.203: IC1.7 v21.84,26.49 | R10.1 19.81,41.56 19.81,41.53 20.85,40.49 | JP3.2 24.93,43.21 24.93,42.79 23.11,40.98 | v20.19,38.35 20.72,38.88 20.72,39.52 | 20.85,40.49 20.72,40.36 20.72,39.52 | 20.85,40.49 C27.2 | 20.72,39.52 22.18,40.98 23.11,40.98 | 23.11,40.98 23.24,40.98 | 23.24,40.98 SW1.1 | 23.24,40.98 24.09,40.13 30.16,40.13 30.93,40.89 SW1.2
  Bottom 0.203: v20.19,38.35 20.7,37.85 20.7,36.32 21.84,35.18 v21.84,26.49
PC5  (via drill 0.35)
  Top 0.203: IC1.25 26.44,19.13 25.27,17.96 25.27,14.4 v26.54,13.13 | v24.13,8.26 24.13,7.53 23.39,6.8 23.39,4.85 JP1.7
  Bottom 0.203: v26.54,13.13 24.13,10.72 v24.13,8.26
PC14-OSC32-IN
  Top 0.203: C37.1 17.52,35.67 Y2.2 17.73,33.96 18.54,33.15 18.54,29.58 19.66,28.46 20.42,28.46 IC1.3
PC15-OSC32-OUT
  Top 0.203: Y2.1 17.73,32.35 17.73,30.73 C2.1 17.73,28.75 18.49,27.99 IC1.4
PH0-OSC-IN
  Top 0.203: IC1.5 20.45,27.5 14.49,27.5 8.27,21.28 C35.1 6.76,17.55 Y1.2
PH1-OSC-OUT
  Top 0.203: R4.1 9.32,14.26 9.32,21.06 15.25,26.99 IC1.6
SWCLK
  Top 0.203: IC1.49 32.36,33.9 32.36,42.31 32.01,42.66 32.01,43.31 32.64,43.95 32.64,45.85 JP3.6
SWDIO
  Top 0.203: IC1.46 31.93,28.51 31.01,28.51 30.81,28.71 30.81,29.75 32.89,31.83 32.89,40.11 33.29,40.5 34.71,40.5 35.19,40.98 35.19,45.86 JP3.8
SWO  (via drill 0.35)
  Top 0.203: JP3.4 30.1,48.39 v30.1,48.51 | v27.13,33.02 26.94,32.84 IC1.55
  Bottom 0.203: v30.1,48.51 30.1,46.59 29.33,45.82 28.31,45.82 26.57,44.08 26.57,33.58 v27.13,33.02
TIM1_CH1
  Top 0.203: IC1.41 32.95,25.99 33.87,25.07 38.82,25.07 42.67,28.92 42.67,36.45 43.56,37.34 JP4.3
TIM1_CH2  (via drill 0.35)
  Top 0.203: v45.85,37.97 JP4.4 | v34.09,26.14 33.73,26.49 IC1.42
  Bottom 0.203: v34.09,26.14 38.08,26.14 41.53,29.59 41.53,37.47 42.62,38.56 45.26,38.56 v45.85,37.97
TIM1_CH3
  Top 0.203: IC1.43 33.58,26.99 33.8,27.22 37.42,27.22 40.39,30.18 40.39,38.48 41.78,39.88 JP4.1
TIM1_CH4  (via drill 0.35)
  Top 0.203: IC1.44 33.33,27.49 34.03,28.19 v34.54,28.19 | v47.37,41.4 47.37,40.77 JP4.2
  Bottom 0.203: v47.37,41.4 45.59,43.18 43.01,43.18 39.22,39.39 39.22,34.56 34.54,29.89 v34.54,28.19
TIM2_CH1  (via drill 0.35)
  Top 0.203: IC1.14 20.5,23.04 21.33,23.04 22.1,23.81 v22.1,24.77 | v4.95,36.32 3.94,35.31 JP5.1
  Bottom 0.203: v4.95,36.32 5.21,36.58 10.53,36.58 22.1,25.01 v22.1,24.77
TIM2_CH2  (via drill 0.35)
  Top 0.203: IC1.15 21.99,22.49 v22.8,23.31 | JP5.2 9.4,35.31 v16.51,28.19
  Bottom 0.203: v22.8,23.31 21.51,23.31 16.63,28.19 v16.51,28.19
TIM2_CH3  (via drill 0.35)
  Top 0.203: v8.76,29.72 6.86,29.72 JP5.6 | IC1.29 28.44,19.17 27.37,18.1 v26.42,18.1
  Bottom 0.203: v8.76,29.72 8.76,29.08 13.84,24 17.27,24 20.9,20.37 24.78,20.37 26.42,18.74 v26.42,18.1
TIM2_CH4  (via drill 0.35)
  Top 0.203: v10.77,24.89 6.71,28.96 5.08,28.96 JP5.5 | IC1.30 28.97,19.98 28.97,17.93 28.06,17.02 v25.98,17.02
  Bottom 0.203: v10.77,24.89 10.78,24.9 12.65,23.04 17.3,23.04 20.7,19.63 23.93,19.63 24.89,18.68 24.89,18.11 v25.98,17.02
TIM15_CH1  (via drill 0.35)
  Top 0.203: IC1.16 21.8,21.99 v21.97,21.82 | v5.33,33.91 4.95,33.91 JP5.3
  Bottom 0.203: v21.97,21.82 17.75,26.04 16.51,26.04 8.56,33.98 5.41,33.98 v5.33,33.91
TIM15_CH2  (via drill 0.35)
  Top 0.203: JP4.5 v45.06,33.68 | IC1.36 32.77,23.49 33.03,23.75 v34.08,23.75
  Bottom 0.203: v34.08,23.75 34.11,23.77 39.6,23.77 45.06,29.23 v45.06,33.68
TIM16_CH1  (via drill 0.35)
  Top 0.203: IC1.22 24.94,21.35 v24.77,21.53 | v13.08,27.05 7.37,32.77 JP5.4
  Bottom 0.203: v24.77,21.53 23.05,21.53 22.63,21.11 21.3,21.11 17.64,24.77 15.48,24.77 13.2,27.05 v13.08,27.05
USART1_RX  (via drill 0.35)
  Top 0.203: IC1.59 24.94,32.94 v24.87,33.02 | v20.19,42.8 JP7.1
  Bottom 0.203: v24.87,33.02 23.62,34.27 23.62,41.91 22.73,42.8 v20.19,42.8
USART1_TX  (via drill 0.35)
  Top 0.203: IC1.58 25.44,32.46 v25.98,32.99 | v24.13,43.05 22.73,44.45 JP7.3
  Bottom 0.203: v25.98,32.99 25.98,33.2 24.13,35.05 v24.13,43.05
USART3_RX  (via drill 0.35)
  Top 0.203: JP3.1 28.83,42.93 v28.7,42.8 | v28.32,34.55 28.45,34.42 IC1.52
  Bottom 0.203: v28.7,42.8 28.7,34.93 v28.32,34.55
USART3_TX  (via drill 0.35)
  Top 0.203: IC1.51 28.94,34.1 v29.46,34.62 | v30.23,42.8 31.37,43.94 JP3.3
  Bottom 0.203: v29.46,34.62 29.46,42.04 v30.23,42.8
VDDA/VREF+
  Top 0.203: IC1.13 20.43,23.47 19.61,23.47 19.41,23.27 19.41,19.64 18.03,18.26 | 18.03,18.26 C34.1 18.26,18.37 18.67,17.96 C23.1 | 18.03,18.26 15.8,18.26 C33.1 13.41,18.28 C40.1 13.38,17.1 C12.1 14.03,16.45 FB1.1

### Text on the board
tPlace: 3V3 | GND | NRST | SWO | SWCLK | SWDIO | cUWUb3D | UART1 | LED_R | UART3 | RX | TX | RX | TX | BOOT | T1_3 | T1_4 | Ryan Chau / Eric Hsieh / Anna Koh / Sachen Sampath / Christine Wan | T1_1 | T1_2 | T15_2 | GND | T2_1 | T2_2 | T15_1 | T2_4 | T16_1 | T2_3 | GND | GND | GND | ADC_9 | ADC_8 | 5V | 3V3 | 5V | 3V3 | 5V_IN | 3V3 | I2C3 | I2C1 | I2C2 | GND | 3V3 | 5V